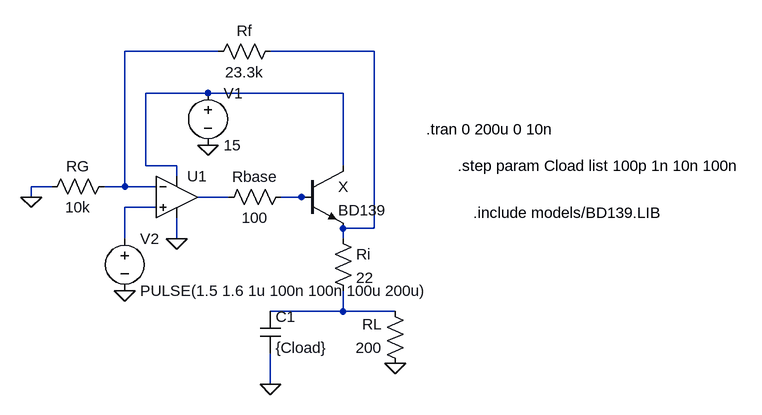
[diagram p0: schematic 03_sweep_source_load_sweep.asc]
03_sweep_source_load_sweep.asc, the LTspice schematic file:
Version 4.1
SHEET 1 1176 680
WIRE 320 -32 176 -32
WIRE 560 -32 400 -32
WIRE 304 32 208 32
WIRE 512 32 304 32
WIRE 208 144 208 32
WIRE 256 144 208 144
WIRE 512 144 512 32
WIRE 256 160 256 144
WIRE 64 176 32 176
WIRE 176 176 176 -32
WIRE 176 176 144 176
WIRE 224 176 176 176
WIRE 32 192 32 176
WIRE 336 192 288 192
WIRE 448 192 416 192
WIRE 464 192 448 192
WIRE 224 208 176 208
WIRE 560 240 560 -32
WIRE 560 240 512 240
WIRE 176 256 176 208
WIRE 256 256 256 224
WIRE 512 256 512 240
WIRE 512 368 512 336
WIRE 512 368 400 368
WIRE 592 368 512 368
WIRE 400 480 400 432
FLAG 176 336 0
FLAG 32 192 0
FLAG 592 448 0
FLAG 256 256 0
FLAG 304 112 0
FLAG 400 480 0
SYMBOL OpAmps\\UniversalOpAmp2 256 192 R0
SYMATTR InstName U1
SYMBOL voltage 176 240 R0
WINDOW 123 0 0 Left 0
WINDOW 39 0 0 Left 0
SYMATTR InstName V2
SYMATTR Value PULSE(1.5 1.6 1u 100n 100n 100u 200u)
SYMBOL res 160 160 R90
WINDOW 0 0 56 VBottom 2
WINDOW 3 32 56 VTop 2
SYMATTR InstName RG
SYMATTR Value 10k
SYMBOL npn 448 144 R0
SYMATTR InstName X
SYMATTR Value BD139
SYMATTR Prefix X
SYMBOL res 416 -48 R90
WINDOW 0 0 56 VBottom 2
WINDOW 3 32 56 VTop 2
SYMATTR InstName Rf
SYMATTR Value 23.3k
SYMBOL res 608 464 R180
WINDOW 0 36 76 Left 2
WINDOW 3 36 40 Left 2
SYMATTR InstName RL
SYMATTR Value 200
SYMBOL voltage 304 16 R0
SYMATTR InstName V1
SYMATTR Value 15
SYMBOL res 432 176 R90
WINDOW 0 0 56 VBottom 2
WINDOW 3 32 56 VTop 2
SYMATTR InstName Rbase
SYMATTR Value 100
SYMBOL cap 384 368 R0
SYMATTR InstName C1
SYMATTR Value {Cload}
SYMBOL res 496 240 R0
SYMATTR InstName Ri
SYMATTR Value 22
TEXT 640 88 Left 2 !.tran 0 200u 0 10n
TEXT 712 216 Left 2 !.include models/BD139.LIB
TEXT 688 144 Left 2 !.step param Cload list 100p 1n 10n 100n

The netlist it stands for:
* 03_sweep_source_load_sweep.asc
X§U1 N006 N001 N003 0 N004 level2 Avol=1Meg GBW=10Meg Slew=10Meg Ilimit=25m Rail=0 Vos=0 En=0 Enk=0 In=0 Ink=0 Rin=500Meg  ; pins In+ In- V+ V- OUT
V2 N006 0 PULSE(1.5 1.6 1u 100n 100n 100u 200u)
RG N001 0 10k
X§X N003 N005 N002 BD139  ; pins C B E
Rf N002 N001 23.3k
RL 0 N007 200
V1 N003 0 15
Rbase N005 N004 100
C1 N007 0 {Cload}
Ri N002 N007 22
.tran 0 200u 0 10n
.include models/BD139.LIB
.step param Cload list 100p 1n 10n 100n
.lib UniversalOpAmp2.lib
.backanno
.end